# Altium schematic sheet Sheet1.SchDoc
size A2
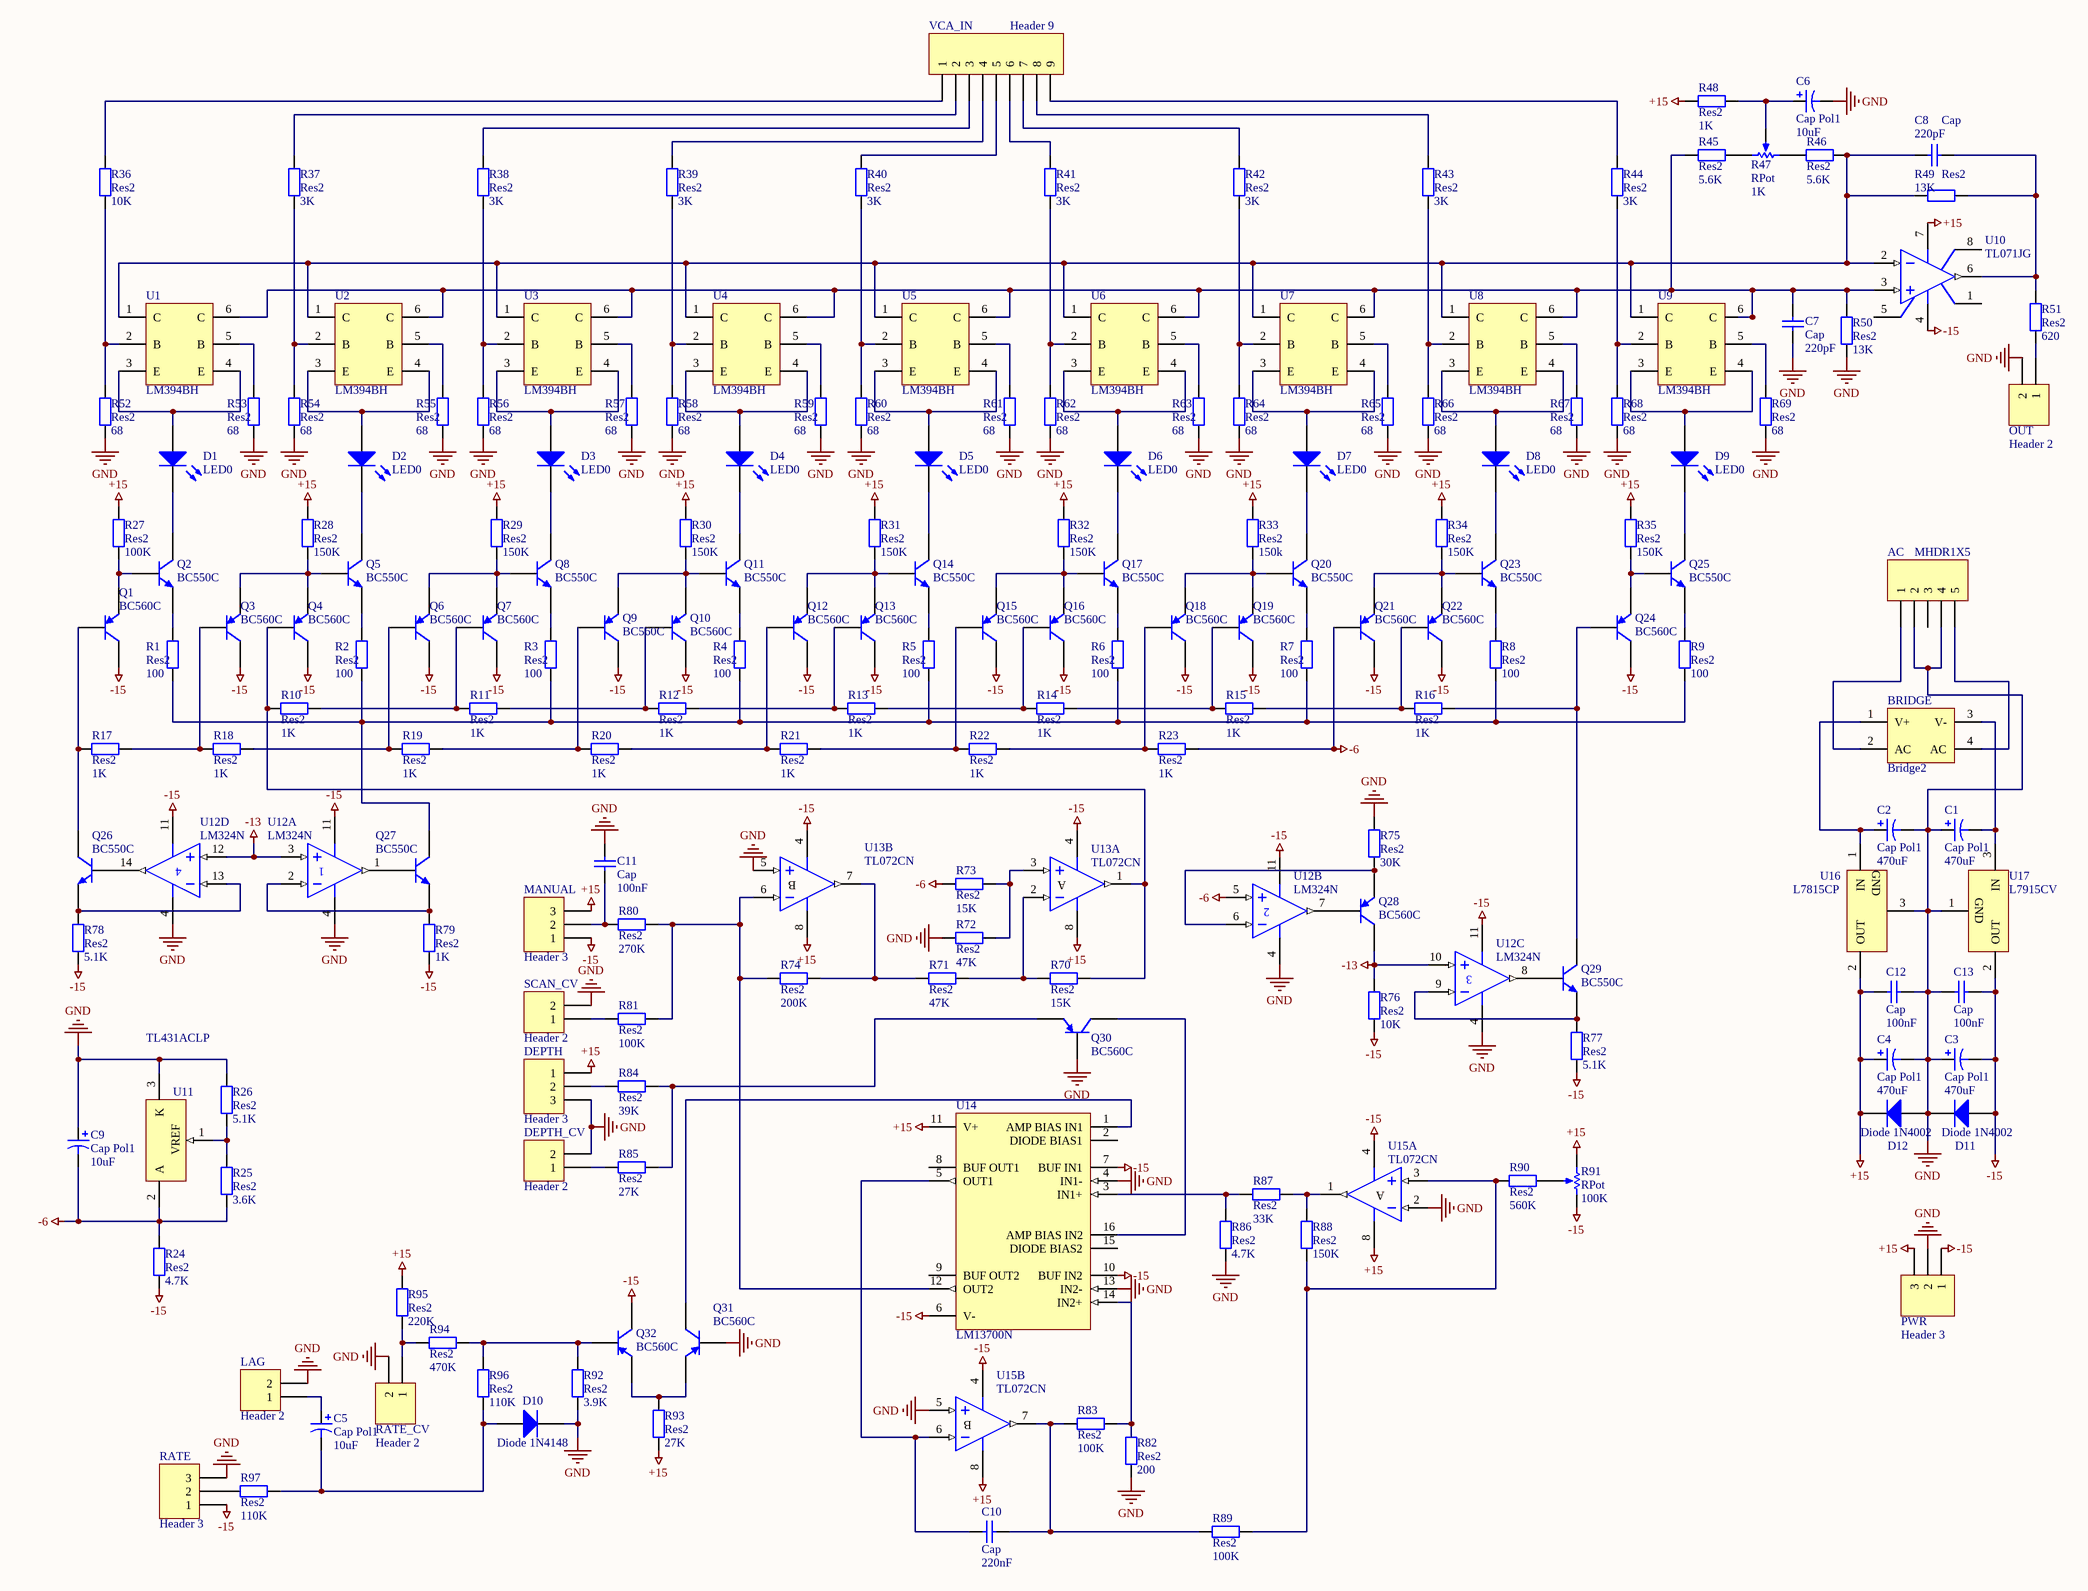
[diagram p0: Sheet1.SchDoc]

## Parts
AC  MHDR1X5  [MHDR1X5]
BRIDGE  Bridge2  [D-46_6A]
C1  Cap Pol1  value 470uF  [B]
C2  Cap Pol1  value 470uF  [B]
C3  Cap Pol1  value 470uF  [B]
C4  Cap Pol1  value 470uF  [B]
C5  Cap Pol1  value 10uF  [B]
C6  Cap Pol1  value 10uF  [B]
C7  Cap  value 220pF  [VP45-3.2]
C8  Cap  value 220pF  [VP45-3.2]
C9  Cap Pol1  value 10uF  [B]
C10  Cap  value 220nF  [VP45-3.2]
C11  Cap  value 100nF  [VP45-3.2]
C12  Cap  value 100nF  [VP45-3.2]
C13  Cap  value 100nF  [VP45-3.2]
D1  LED0  [LED-0]
D2  LED0  [LED-0]
D3  LED0  [LED-0]
D4  LED0  [LED-0]
D5  LED0  [LED-0]
D6  LED0  [LED-0]
D7  LED0  [LED-0]
D8  LED0  [LED-0]
D9  LED0  [LED-0]
D10  Diode 1N4148  [DO-35]
D11  Diode 1N4002  [DO-41]
D12  Diode 1N4002  [DO-41]
DEPTH  Header 3  [HDR1X3]
DEPTH_CV  Header 2  [HDR1X2]
LAG  Header 2  [HDR1X2]
MANUAL  Header 3  [HDR1X3]
OUT  Header 2  [HDR1X2]
PWR  Header 3  [HDR1X3]
Q1  BC560C  [29-04]
Q2  BC550C  [29-04]
Q3  BC560C  [29-04]
Q4  BC560C  [29-04]
Q5  BC550C  [29-04]
Q6  BC560C  [29-04]
Q7  BC560C  [29-04]
Q8  BC550C  [29-04]
Q9  BC560C  [29-04]
Q10  BC560C  [29-04]
Q11  BC550C  [29-04]
Q12  BC560C  [29-04]
Q13  BC560C  [29-04]
Q14  BC550C  [29-04]
Q15  BC560C  [29-04]
Q16  BC560C  [29-04]
Q17  BC550C  [29-04]
Q18  BC560C  [29-04]
Q19  BC560C  [29-04]
Q20  BC550C  [29-04]
Q21  BC560C  [29-04]
Q22  BC560C  [29-04]
Q23  BC550C  [29-04]
Q24  BC560C  [29-04]
Q25  BC550C  [29-04]
Q26  BC550C  [29-04]
Q27  BC550C  [29-04]
Q28  BC560C  [29-04]
Q29  BC550C  [29-04]
Q30  BC560C  [29-04]
Q31  BC560C  [29-04]
Q32  BC560C  [29-04]
R1  Res2  value 100  [AXIAL-0.4]
R2  Res2  value 100  [AXIAL-0.4]
R3  Res2  value 100  [AXIAL-0.4]
R4  Res2  value 100  [AXIAL-0.4]
R5  Res2  value 100  [AXIAL-0.4]
R6  Res2  value 100  [AXIAL-0.4]
R7  Res2  value 100  [AXIAL-0.4]
R8  Res2  value 100  [AXIAL-0.4]
R9  Res2  value 100  [AXIAL-0.4]
R10  Res2  value 1K  [AXIAL-0.4]
R11  Res2  value 1K  [AXIAL-0.4]
R12  Res2  value 1K  [AXIAL-0.4]
R13  Res2  value 1K  [AXIAL-0.4]
R14  Res2  value 1K  [AXIAL-0.4]
R15  Res2  value 1K  [AXIAL-0.4]
R16  Res2  value 1K  [AXIAL-0.4]
R17  Res2  value 1K  [AXIAL-0.4]
R18  Res2  value 1K  [AXIAL-0.4]
R19  Res2  value 1K  [AXIAL-0.4]
R20  Res2  value 1K  [AXIAL-0.4]
R21  Res2  value 1K  [AXIAL-0.4]
R22  Res2  value 1K  [AXIAL-0.4]
R23  Res2  value 1K  [AXIAL-0.4]
R24  Res2  value 4.7K  [AXIAL-0.4]
R25  Res2  value 3.6K  [AXIAL-0.4]
R26  Res2  value 5.1K  [AXIAL-0.4]
R27  Res2  value 100K  [AXIAL-0.4]
R28  Res2  value 150K  [AXIAL-0.4]
R29  Res2  value 150K  [AXIAL-0.4]
R30  Res2  value 150K  [AXIAL-0.4]
R31  Res2  value 150K  [AXIAL-0.4]
R32  Res2  value 150K  [AXIAL-0.4]
R33  Res2  value 150k  [AXIAL-0.4]
R34  Res2  value 150K  [AXIAL-0.4]
R35  Res2  value 150K  [AXIAL-0.4]
R36  Res2  value 10K  [AXIAL-0.4]
R37  Res2  value 3K  [AXIAL-0.4]
R38  Res2  value 3K  [AXIAL-0.4]
R39  Res2  value 3K  [AXIAL-0.4]
R40  Res2  value 3K  [AXIAL-0.4]
R41  Res2  value 3K  [AXIAL-0.4]
R42  Res2  value 3K  [AXIAL-0.4]
R43  Res2  value 3K  [AXIAL-0.4]
R44  Res2  value 3K  [AXIAL-0.4]
R45  Res2  value 5.6K  [AXIAL-0.4]
R46  Res2  value 5.6K  [AXIAL-0.4]
R47  RPot  value 1K  [VR5]
R48  Res2  value 1K  [AXIAL-0.4]
R49  Res2  value 13K  [AXIAL-0.4]
R50  Res2  value 13K  [AXIAL-0.4]
R51  Res2  value 620  [AXIAL-0.4]
R52  Res2  value 68  [AXIAL-0.4]
R53  Res2  value 68  [AXIAL-0.4]
R54  Res2  value 68  [AXIAL-0.4]
R55  Res2  value 68  [AXIAL-0.4]
R56  Res2  value 68  [AXIAL-0.4]
R57  Res2  value 68  [AXIAL-0.4]
R58  Res2  value 68  [AXIAL-0.4]
R59  Res2  value 68  [AXIAL-0.4]
R60  Res2  value 68  [AXIAL-0.4]
R61  Res2  value 68  [AXIAL-0.4]
R62  Res2  value 68  [AXIAL-0.4]
R63  Res2  value 68  [AXIAL-0.4]
R64  Res2  value 68  [AXIAL-0.4]
R65  Res2  value 68  [AXIAL-0.4]
R66  Res2  value 68  [AXIAL-0.4]
R67  Res2  value 68  [AXIAL-0.4]
R68  Res2  value 68  [AXIAL-0.4]
R69  Res2  value 68  [AXIAL-0.4]
R70  Res2  value 15K  [AXIAL-0.4]
R71  Res2  value 47K  [AXIAL-0.4]
R72  Res2  value 47K  [AXIAL-0.4]
R73  Res2  value 15K  [AXIAL-0.4]
R74  Res2  value 200K  [AXIAL-0.4]
R75  Res2  value 30K  [AXIAL-0.4]
R76  Res2  value 10K  [AXIAL-0.4]
R77  Res2  value 5.1K  [AXIAL-0.4]
R78  Res2  value 5.1K  [AXIAL-0.4]
R79  Res2  value 1K  [AXIAL-0.4]
R80  Res2  value 270K  [AXIAL-0.4]
R81  Res2  value 100K  [AXIAL-0.4]
R82  Res2  value 200  [AXIAL-0.4]
R83  Res2  value 100K  [AXIAL-0.4]
R84  Res2  value 39K  [AXIAL-0.4]
R85  Res2  value 27K  [AXIAL-0.4]
R86  Res2  value 4.7K  [AXIAL-0.4]
R87  Res2  value 33K  [AXIAL-0.4]
R88  Res2  value 150K  [AXIAL-0.4]
R89  Res2  value 100K  [AXIAL-0.4]
R90  Res2  value 560K  [AXIAL-0.4]
R91  RPot  value 100K  [VR5]
R92  Res2  value 3.9K  [AXIAL-0.4]
R93  Res2  value 27K  [AXIAL-0.4]
R94  Res2  value 470K  [AXIAL-0.4]
R95  Res2  value 220K  [AXIAL-0.4]
R96  Res2  value 110K  [AXIAL-0.4]
R97  Res2  value 110K  [AXIAL-0.4]
RATE  Header 3  [HDR1X3]
RATE_CV  Header 2  [HDR1X2]
SCAN_CV  Header 2  [HDR1X2]
U1  LM394BH  [H06C]
U2  LM394BH  [H06C]
U3  LM394BH  [H06C]
U4  LM394BH  [H06C]
U5  LM394BH  [H06C]
U6  LM394BH  [H06C]
U7  LM394BH  [H06C]
U8  LM394BH  [H06C]
U9  LM394BH  [H06C]
U10  TL071JG  [JG008]
U11  TL431ACLP  [LP03]
U12  LM324N  [646-06]  (parts A,B,C,D of 4)
U13  TL072CN  [DIP8]  (parts A,B of 2)
U14  LM13700N  [N16E]
U15  TL072CN  [DIP8]  (parts A,B of 2)
U16  L7815CP  [ISOWATT220AB]
U17  L7915CV  [TO220V]
VCA_IN  Header 9  [HDR1X9]

## Nets
+15: C4.1 C12.1 D12.2(K) DEPTH.1 MANUAL.3 PWR.3 R27.2 R28.2 R29.2 R30.2 R31.2 R32.2 R33.2 R34.2 R35.2 R48.2 R91.1(TOP) R93.1 R95.2 U10.7(V+) U13.8(V+) U14.11(V+) U15.8(V+) U16.2(OUT)
-6: C9.2 Q21.2(B) R23.2 R24.2 R25.1 R73.1 U11.2(A) U12.5(IN+)
-13: Q28.1(C) R76.2 U12.3(IN+) U12.10(IN+) U12.12(IN+)
-15: C3.2 C13.2 D11.1(A) MANUAL.1 PWR.1 Q1.1(C) Q3.1(C) Q4.1(C) Q6.1(C) Q7.1(C) Q9.1(C) Q10.1(C) Q12.1(C) Q13.1(C) Q15.1(C) Q16.1(C) Q18.1(C) Q19.1(C) Q21.1(C) Q22.1(C) Q24.1(C) Q32.1(C) R24.1 R76.1 R77.1 R78.1 R79.1 R91.2(BOT) RATE.1 U10.4(V-) U12.11(V-) U13.4(V-) U14.6(V-) U14.7(BUF_IN1) U14.10(BUF_IN2) U15.4(V-) U17.2(OUT)
GND: AC.2 AC.4 C1.1 C2.2 C3.1 C4.2 C6.2 C7.1 C9.1 C11.2 C12.2 C13.1 D10.2(K) D11.2(K) D12.1(A) DEPTH.3 DEPTH_CV.2 LAG.2 OUT.2 PWR.2 Q30.2(B) Q31.2(B) R26.2 R50.1 R52.1 R53.1 R54.1 R55.1 R56.1 R57.1 R58.1 R59.1 R60.1 R61.1 R62.1 R63.1 R64.1 R65.1 R66.1 R67.1 R68.1 R69.1 R72.2 R75.2 R82.1 R86.2 R92.1 RATE.3 RATE_CV.2 SCAN_CV.2 U11.3(K) U12.4(V+) U13.5(IN+) U14.4(IN1-) U14.13(IN2-) U15.2(IN-) U15.5(IN+) U16.3(GND) U17.1(GND)
NetAC_1: AC.1 BRIDGE.2(AC)
NetAC_5: AC.5 BRIDGE.4(AC)
NetBRIDGE_1: BRIDGE.1(V+) C2.1 U16.1(IN)
NetBRIDGE_3: BRIDGE.3(V-) C1.2 U17.3(IN)
NetC5_1: C5.1 LAG.1
NetC5_2: C5.2 D10.1(A) R96.1 R97.2
NetC6_1: C6.1 R47.3(TAP) R48.1
NetC7_2: C7.2 R45.2 R50.2 U1.6(C) U2.6(C) U3.6(C) U4.6(C) U5.6(C) U6.6(C) U7.6(C) U8.6(C) U9.6(C) U10.3(IN+)
NetC8_1: C8.1 R49.1 R51.2 U10.6(OUT)
NetC8_2: C8.2 R46.1 R49.2 U1.1(C) U2.1(C) U3.1(C) U4.1(C) U5.1(C) U6.1(C) U7.1(C) U8.1(C) U9.1(C) U10.2(IN-)
NetC10_1: C10.1 R83.2 R89.2 U15.7(OUT)
NetC10_2: C10.2 U14.5(OUT1) U15.6(IN-)
NetC11_1: C11.1 MANUAL.2 R80.1
NetD1_1: D1.1(A) U1.3(E) U1.4(E)
NetD1_2: D1.2(K) Q2.1(C)
NetD2_1: D2.1(A) U2.3(E) U2.4(E)
NetD2_2: D2.2(K) Q5.1(C)
NetD3_1: D3.1(A) U3.3(E) U3.4(E)
NetD3_2: D3.2(K) Q8.1(C)
NetD4_1: D4.1(A) U4.3(E) U4.4(E)
NetD4_2: D4.2(K) Q11.1(C)
NetD5_1: D5.1(A) U5.3(E) U5.4(E)
NetD5_2: D5.2(K) Q14.1(C)
NetD6_1: D6.1(A) U6.3(E) U6.4(E)
NetD6_2: D6.2(K) Q17.1(C)
NetD7_1: D7.1(A) U7.3(E) U7.4(E)
NetD7_2: D7.2(K) Q20.1(C)
NetD8_1: D8.1(A) U8.3(E) U8.4(E)
NetD8_2: D8.2(K) Q23.1(C)
NetD9_1: D9.1(A) U9.3(E) U9.4(E)
NetD9_2: D9.2(K) Q25.1(C)
NetDEPTH_2: DEPTH.2 R84.1
NetDEPTH_CV_1: DEPTH_CV.1 R85.1
NetOUT_1: OUT.1 R51.1
NetQ1_2: Q1.2(B) Q26.1(C) R17.1
NetQ1_3: Q1.3(E) Q2.2(B) R27.1
NetQ2_3: Q2.3(E) R1.2
NetQ3_2: Q3.2(B) R17.2 R18.1
NetQ3_3: Q3.3(E) Q4.3(E) Q5.2(B) R28.1
NetQ4_2: Q4.2(B) R10.1 R70.2 U13.1(OUT)
NetQ5_3: Q5.3(E) R2.2
NetQ6_2: Q6.2(B) R18.2 R19.1
NetQ6_3: Q6.3(E) Q7.3(E) Q8.2(B) R29.1
NetQ7_2: Q7.2(B) R10.2 R11.1
NetQ8_3: Q8.3(E) R3.2
NetQ9_2: Q9.2(B) R19.2 R20.1
NetQ9_3: Q9.3(E) Q10.3(E) Q11.2(B) R30.1
NetQ10_2: Q10.2(B) R11.2 R12.1
NetQ11_3: Q11.3(E) R4.2
NetQ12_2: Q12.2(B) R20.2 R21.1
NetQ12_3: Q12.3(E) Q13.3(E) Q14.2(B) R31.1
NetQ13_2: Q13.2(B) R12.2 R13.1
NetQ14_3: Q14.3(E) R5.2
NetQ15_2: Q15.2(B) R21.2 R22.1
NetQ15_3: Q15.3(E) Q16.3(E) Q17.2(B) R32.1
NetQ16_2: Q16.2(B) R13.2 R14.1
NetQ17_3: Q17.3(E) R6.2
NetQ18_2: Q18.2(B) R22.2 R23.1
NetQ18_3: Q18.3(E) Q19.3(E) Q20.2(B) R33.1
NetQ19_2: Q19.2(B) R14.2 R15.1
NetQ20_3: Q20.3(E) R7.2
NetQ21_3: Q21.3(E) Q22.3(E) Q23.2(B) R34.1
NetQ22_2: Q22.2(B) R15.2 R16.1
NetQ23_3: Q23.3(E) R8.2
NetQ24_2: Q24.2(B) Q29.1(C) R16.2
NetQ24_3: Q24.3(E) Q25.2(B) R35.1
NetQ25_3: Q25.3(E) R9.2
NetQ26_2: Q26.2(B) U12.14(OUT)
NetQ26_3: Q26.3(E) R78.2 U12.13(IN-)
NetQ27_1: Q27.1(C) R1.1 R2.1 R3.1 R4.1 R5.1 R6.1 R7.1 R8.1 R9.1
NetQ27_2: Q27.2(B) U12.1(OUT)
NetQ27_3: Q27.3(E) R79.2 U12.2(IN-)
NetQ28_2: Q28.2(B) U12.7(OUT)
NetQ28_3: Q28.3(E) R75.1 U12.6(IN-)
NetQ29_2: Q29.2(B) U12.8(OUT)
NetQ29_3: Q29.3(E) R77.2 U12.9(IN-)
NetQ30_1: Q30.1(C) U14.16(AMP_BIAS_IN2)
NetQ30_3: Q30.3(E) R84.2 R85.2
NetQ31_1: Q31.1(C) U14.1(AMP_BIAS_IN1)
NetQ31_3: Q31.3(E) Q32.3(E) R93.2
NetQ32_2: Q32.2(B) R92.2 R94.2 R96.2
NetR25_2: R25.2 R26.1 U11.1(VREF)
NetR36_1: R36.1 R52.2 U1.2(B)
NetR36_2: R36.2 VCA_IN.1
NetR37_1: R37.1 R54.2 U2.2(B)
NetR37_2: R37.2 VCA_IN.2
NetR38_1: R38.1 R56.2 U3.2(B)
NetR38_2: R38.2 VCA_IN.3
NetR39_1: R39.1 R58.2 U4.2(B)
NetR39_2: R39.2 VCA_IN.4
NetR40_1: R40.1 R60.2 U5.2(B)
NetR40_2: R40.2 VCA_IN.5
NetR41_1: R41.1 R62.2 U6.2(B)
NetR41_2: R41.2 VCA_IN.6
NetR42_1: R42.1 R64.2 U7.2(B)
NetR42_2: R42.2 VCA_IN.7
NetR43_1: R43.1 R66.2 U8.2(B)
NetR43_2: R43.2 VCA_IN.8
NetR44_1: R44.1 R68.2 U9.2(B)
NetR44_2: R44.2 VCA_IN.9
NetR45_1: R45.1 R47.2(BOT)
NetR46_2: R46.2 R47.1(TOP)
NetR53_2: R53.2 U1.5(B)
NetR55_2: R55.2 U2.5(B)
NetR57_2: R57.2 U3.5(B)
NetR59_2: R59.2 U4.5(B)
NetR61_2: R61.2 U5.5(B)
NetR63_2: R63.2 U6.5(B)
NetR65_2: R65.2 U7.5(B)
NetR67_2: R67.2 U8.5(B)
NetR69_2: R69.2 U9.5(B)
NetR70_1: R70.1 R71.2 U13.2(IN-)
NetR71_1: R71.1 R74.2 U13.7(OUT)
NetR72_1: R72.1 R73.2 U13.3(IN+)
NetR74_1: R74.1 R80.2 R81.2 U13.6(IN-) U14.12(OUT2)
NetR81_1: R81.1 SCAN_CV.1
NetR82_2: R82.2 R83.1 U14.14(IN2+)
NetR86_1: R86.1 R87.2 U14.3(IN1+)
NetR87_1: R87.1 R88.2 U15.1(OUT)
NetR88_1: R88.1 R89.1 R90.1 U15.3(IN+)
NetR90_2: R90.2 R91.3(TAP)
NetR94_1: R94.1 R95.1 RATE_CV.1
NetR97_1: R97.1 RATE.2

Not connected (* = marked no-connect by the designer): AC 3; U10 1(OS_TRIM) 5(OS_TRIM) 8(NC); U14 2(DIODE_BIAS1) 8(BUF_OUT1) 9(BUF_OUT2) 15(DIODE_BIAS2)

## Notes on the sheet
- (in symbol TL072CN, part A) A
- (in symbol TL072CN, part B) B

## Library data of the parts
AC = MHDR1X5: Header, 5-Pin; LatestRevisionDate: 17-Jul-2002; LatestRevisionNote: Re-released for DXP Platform.; Publisher: Altium Limited
BRIDGE = Bridge2: Diode Bridge; Published: 24-Mar-1999; LatestRevisionDate: 17-Jul-2002; LatestRevisionNote: Re-released for DXP Platform.; PackageReference: D-46_6A; Publisher: Altium Limited
C1-C6 C9 = Cap Pol1: Polarized Capacitor (Radial); Published: 8-Jun-2000; LatestRevisionDate: 17-Jul-2002; LatestRevisionNote: Re-released for DXP Platform.; PackageReference: RB7.6-15; Publisher: Altium Limited
C7 C8 C10-C13 = Cap: Capacitor; Published: 8-Jun-2000; LatestRevisionDate: 17-Jul-2002; LatestRevisionNote: Re-released for DXP Platform.; PackageReference: RAD-0.3; Publisher: Altium Limited
D1-D9 = LED0: Typical INFRARED GaAs LED; Published: 8-Jun-2000; LatestRevisionDate: 08-Jul-2005; LatestRevisionNote: Mech Layer 1 removed.; PackageReference: LED-0; Publisher: Altium Limited
D10 = Diode 1N4148: High Conductance Fast Diode; Published: 8-Jun-2000; LatestRevisionDate: 17-Jul-2002; LatestRevisionNote: Re-released for DXP Platform.; DatasheetDocument: 1997; PackageReference: DO-35; Publisher: Altium Limited; Code_JEDEC: DO-204-AH; ComponentLink1Description: Manufacturer Link; ComponentLink1URL: http://www.fairchildsemi.com/; ComponentLink2Description: Datasheet; ComponentLink2URL: http://www.fairchildsemi.com/ds/1N%2F1N4148.pdf
D11 D12 = Diode 1N4002: 1 Amp General Purpose Rectifier; Published: 8-Jun-2000; LatestRevisionDate: 17-Jul-2002; LatestRevisionNote: Re-released for DXP Platform.; DatasheetDocument: 1998; PackageDocument: Aug-1999; PackageReference: DO-41; Publisher: Altium Limited; Code_JEDEC: DO-204-AL; ComponentLink1Description: Manufacturer Link; ComponentLink1URL: http://www.fairchildsemi.com/; ComponentLink2Description: Datasheet; ComponentLink2URL: http://www.fairchildsemi.com/ds/1N%2F1N4001.pdf
DEPTH MANUAL PWR RATE = Header 3: Header, 3-Pin; LatestRevisionDate: 17-Jul-2002; LatestRevisionNote: Re-released for DXP Platform.; Publisher: Altium Limited
DEPTH_CV LAG OUT RATE_CV SCAN_CV = Header 2: Header, 2-Pin; LatestRevisionDate: 17-Jul-2002; LatestRevisionNote: Re-released for DXP Platform.; Publisher: Altium Limited
Q1 Q3 Q4 Q6 Q7 Q9 Q10 Q12 Q13 Q15 Q16 Q18 Q19 Q21 Q22 Q24 Q28 Q30-Q32 = BC560C: Low Noise Transistor PNP Silicon; Published: 29-Sep-2000; LatestRevisionDate: 17-Jul-2002; LatestRevisionNote: Re-released for DXP Platform.; DatasheetVersion: 1997; PackageVersion: 1996; PackageReference: 29-04; Publisher: Altium Limited; PackageDescription: TO, Flat Index; 3 In-Line, Axial Leads; Body Dia. 4.8mm; Leads 0.48 x 0.5 mm (max); ComponentLink1Description: Manufacturer Link; ComponentLink1URL: http://www.onsemi.com/site/products/landing?taxonomyID=194; ComponentLink2Description: Datasheet; ComponentLink2URL: http://www.onsemi.com/pub/Collateral/BC559-D.PDF
Q2 Q5 Q8 Q11 Q14 Q17 Q20 Q23 Q25-Q27 Q29 = BC548C: Amplifier Transistor NPN Silicon; Published: 29-Sep-2000; LatestRevisionDate: 17-Jul-2002; LatestRevisionNote: Re-released for DXP Platform.; DatasheetVersion: 1991; PackageVersion: 1996; PackageReference: 29-04; Publisher: Altium Limited; PackageDescription: TO, Flat Index; 3 In-Line, Axial Leads; Body Dia. 4.8mm; Leads 0.48 x 0.5 mm (max); ComponentLink1Description: Manufacturer Link; ComponentLink1URL: http://www.onsemi.com/site/products/landing?taxonomyID=194; ComponentLink2Description: Datasheet; ComponentLink2URL: http://www.onsemi.com/pub/Collateral/BC546-D.PDF
R1-R46 R48-R90 R92-R97 = Res2: Resistor; Published: 8-Jun-2000; LatestRevisionDate: 17-Jul-2002; LatestRevisionNote: Re-released for DXP Platform.; PackageReference: AXIAL-0.4; Publisher: Altium Limited
R47 R91 = RPot: Potentiometer; Sim Note: Enter the Resistance value and the set point into parameter fields.; Set Position: 0.5; Published: 8-Jun-2000; LatestRevisionDate: 17-Jul-2002; LatestRevisionNote: Re-released for DXP Platform.; PackageReference: VR5; Publisher: Altium Limited
U1-U9 = LM394BH: Supermatch Pair; Manufacturer: National Semiconductor; CompType: Amplifiers; PackageTopMarking: NSZXYTTE# LM394BH; MilaeroCode: 2MC; Published: 27-Nov-2008; DatasheetVersion: Dec-1994; PackageVersion: revE, Jun-1995; PackageReference: H06C; Publisher: Altium Limited; PackageDescription: Metal Can, TO-99, 6 Lead, .200in Dia P.C.; PartNumber: LM394BH; RoHS: O; PinCount: 6; DigiKeyPartNumber: LM394BH-ND; Code_JEDEC: TO-99; ComponentLink1Description: LM394 Datasheet; ComponentLink1URL: http://www.national.com/ds/LM/LM394.pdf; ComponentLink2Description: LM394 Web Page; ComponentLink2URL: http://www.national.com/pf/LM/LM394.html; ComponentLink3Description: H06C package page; ComponentLink3URL: http://www.national.com/packaging/folders/h06c.html
U10 = TL071JG: Low-Noise JFET-Input Operational Amplifier; Note: Pin 8 is not connected; Published: 16-Jan-2001; LatestRevisionDate: 04-Mar-2005; LatestRevisionNote: Stylized 3D Model Added.; DatasheetVersion: Aug-1996; PackageVersion: Jan-1995; PackageReference: JG008; Publisher: Altium Limited; PackageDescription: DIP; 8 Leads; Row Spacing 7.62 mm; Pitch 2.54 mm; ComponentLink1Description: Manufacturer Link; ComponentLink1URL: http://www.ti.com/; ComponentLink2Description: Datasheet; ComponentLink2URL: http://www-s.ti.com/sc/ds/tl071.pdf
U11 = TL431ACLP: Adjustable Precision Shunt Regulator; Published: 15-Apr-2002; LatestRevisionDate: 06-Jun-2005; LatestRevisionNote: Sch pins 1 & 3 swapped; DatasheetVersion: Oct-2000; PackageVersion: Nov-2001; PackageReference: LP03; Publisher: Altium Limited; PackageDescription: TO, Flat Index; 3 In-Line, Axial Leads; Body Dia. 4.8mm; Leads 0.56 x 0.41 mm (max); Code_JEDEC: TO-226-AA; ComponentLink1Description: Manufacturer Link; ComponentLink1URL: http://www.ti.com/; ComponentLink2Description: Datasheet; ComponentLink2URL: http://www-s.ti.com/sc/ds/tl431a.pdf
U12 = LM324N: Quad Low-Power Operational Amplifier; Published: 17-Jul-2002; LatestRevisionDate: 06-Jun-2005; LatestRevisionNote: Stylized 3D Model Added.; DatasheetVersion: 1988; PackageVersion: 1997; PackageReference: 646-06; Publisher: Altium Limited; PackageDescription: DIP; 14 Leads; Row Spacing 7.62 mm; Pitch 2.54 mm; ComponentLink1Description: Manufacturer Link; ComponentLink1URL: http://www.onsemi.com/site/products/parametrics/0,4446,251,00.html; ComponentLink2Description: Datasheet; ComponentLink2URL: http://www.onsemi.com/pub/Collateral/LM324-D.PDF
U13 U15 = TL072CN: Low-Noise J-FET Dual Operational Amplifier; Published: 24-Aug-2001; LatestRevisionDate: 06-Jun-2005; LatestRevisionNote: Stylized 3D Model Added.; DatasheetVersion: Dec-1998; PackageReference: DIP8; Publisher: Altium Limited; PackageDescription: DIP; 8 Leads; Row Spacing 7.62 mm; Pitch 2.54 mm; Code_JEDEC: MO-001-AN; ComponentLink1Description: Manufacturer Link; ComponentLink1URL: http://www.st.com/; ComponentLink2Description: Datasheet; ComponentLink2URL: http://www.st.com/stonline/products/literature/ds/2298/tl072.pdf
U14 = LM13700N: Dual Operational Transconductance Amplifier with Linearizing Diodes and Buffers; Manufacturer: National Semiconductor; CompType: Amplifiers; PackageTopMarking: NSUZXYYTT*LM13700N; Published: 27-Nov-2008; DatasheetVersion: Jun-2004; PackageVersion: revG, May-2006; PackageReference: N16E; Publisher: Altium Limited; PackageDescription: MDIP, .750 x .250 x .130in, 16 Lead, .100in Pitch; PartNumber: LM13700N; RoHS: Y; PinCount: 16; DigiKeyPartNumber: LM13700N-ND; Code_JEDEC: MS-001-BB; ComponentLink1Description: LM13700 Datasheet; ComponentLink1URL: http://www.national.com/ds/LM/LM13700.pdf; ComponentLink2Description: LM13700 Web Page; ComponentLink2URL: http://www.national.com/pf/LM/LM13700.html; ComponentLink3Description: N16E Package Page; ComponentLink3URL: http://www.national.com/packaging/folders/n16e.html
U16 = L7815CP: Positive Voltage Regulator; Note: Tab is connected to pin 3 (GND).; Published: 24-Aug-2001; LatestRevisionDate: 17-Jul-2002; LatestRevisionNote: Re-released for DXP Platform.; DatasheetVersion: Dec-1998; PackageVersion: Jul-1998; PackageReference: ISOWATT220AB; Publisher: Altium Limited; PackageDescription: TO, Thru-Hole, Vertical, Heatsink Mounted; 3 In-Line Leads; Pitch 2.54 mm; Pin sequence 1, 3, 2; ComponentLink1Description: Manufacturer Link; ComponentLink1URL: http://www.st.com/
U17 = L7915CV: Negative Voltage Regulator; Note: Tab is connected to pin 3 (IN).; Published: 24-Aug-2001; LatestRevisionDate: 17-Jul-2002; LatestRevisionNote: Re-released for DXP Platform.; DatasheetVersion: Apr-1997; PackageReference: TO220V; Publisher: Altium Limited; PackageDescription: TO, Thru-Hole, Vertical, Heatsink Mounted; 3 In-Line Leads; Pitch 2.54 mm; Pin sequence 1, 3, 2; ComponentLink1Description: Manufacturer Link; ComponentLink1URL: http://www.st.com/; ComponentLink2Description: Datasheet; ComponentLink2URL: http://www.st.com/stonline/products/literature/ds/2149/l7905c.pdf
VCA_IN = Header 9: Header, 9-Pin; LatestRevisionDate: 17-Jul-2002; LatestRevisionNote: Re-released for DXP Platform.; Publisher: Altium Limited